# EAGLE design frisk-led-test (EAGLE 7.5.0)
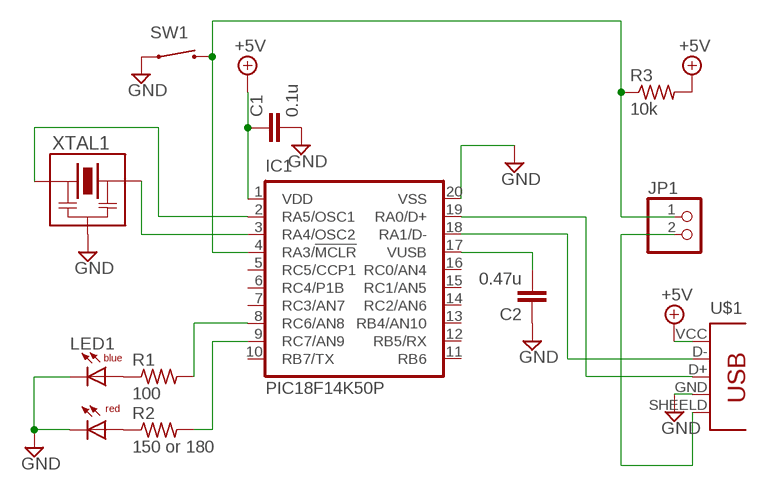
[diagram p0: schematic, sheet 1]

## Parts
C1  0.1u  C-EU025-024X044  [C025-024X044]
C2  0.47u  C-EU075-032X103  [C075-032X103]
IC1  PIC18F14K50P  [DIL20]
JP1  PINHD-1X2  [1X02]
LED1  SML-02  [SML-02]
R1  100  R-US_0204/7  [0204/7]
R2  150 or 180  R-US_0204/7  [0204/7]
R3  10k  R-US_0204/7  [0204/7]
SW1  TVBP06  [TVBP06]
U$1  TYPE-A+SHILED  [TYPE-A]
XTAL1  CSTCE12M0G15L  [CSTCE]

## Nets
+5V: C1.1 IC1.1(VDD) R3.2 U$1.VCC
GND: C1.2 C2.1 IC1.20(VSS) LED1.1(CC1) LED1.3(CC2) SW1.1 U$1.GND XTAL1.2(GND)
N$1: LED1.2(AB) R1.1
N$2: LED1.4(AR) R2.1
N$3: IC1.3(RA4/OSC2) XTAL1.3(RIT)
N$4: IC1.2(RA5/OSC1) XTAL1.1(LFT)
N$5: IC1.8(RC6/AN8) R1.2
N$6: IC1.19(RA0/D+) U$1.D+
N$7: IC1.18(RA1/D-) U$1.D-
N$8: IC1.9(RC7/AN9) R2.2
N$9: IC1.4(RA3/!MCLR!) JP1.1 R3.1 SW1.2
N$10: C2.2 IC1.17(VUSB)
N$11: JP1.2 U$1.SHEELD
Unconnected: IC1.5(RC5/CCP1) IC1.6(RC4/P1B) IC1.7(RC3/AN7) IC1.10(RB7/TX) IC1.11(RB6) IC1.12(RB5/RX) IC1.13(RB4/AN10) IC1.14(RC2/AN6) IC1.15(RC1/AN5) IC1.16(RC0/AN4)

## Library data of the parts
C1 C2 = rcl:C-EU: CAPACITOR, European symbol
IC1 = pic18f14k50:PIC18F14K50
JP1 = pinhead:PINHD-1X2: PIN HEADER
LED1 = led-smd:SML-02: 2color led http://akizukidenshi.com/catalog/g/gI-09437/
R1-R3 = rcl:R-US_: RESISTOR, American symbol
SW1 = switches:TVBP06: 2pin switch. http://akizukidenshi.com/catalog/g/gP-08074/
U$1 = usb-connector:TYPE-A+SHILED
XTAL1 = murata-ceralok:CSTCE12M0G15L: Murata CERALOCK https://jp.rs-online.com/web/p/ceramic-resonators/7926527/

## Board
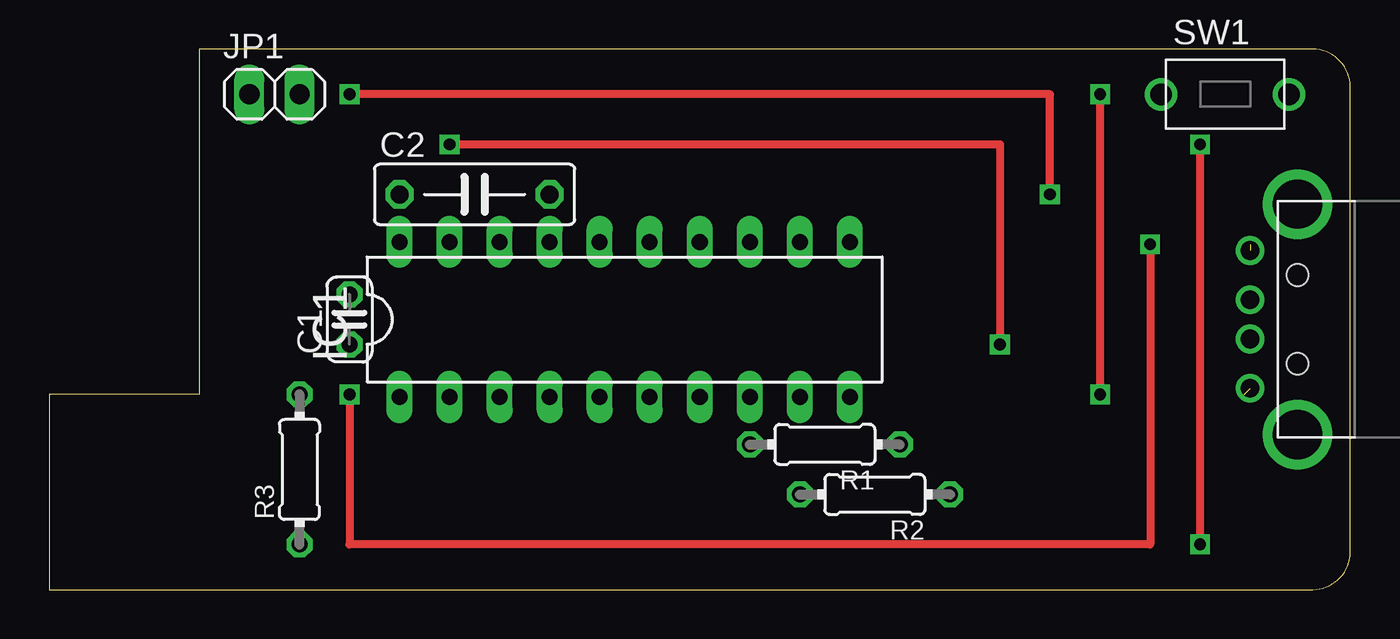
[diagram p1: board, top side]
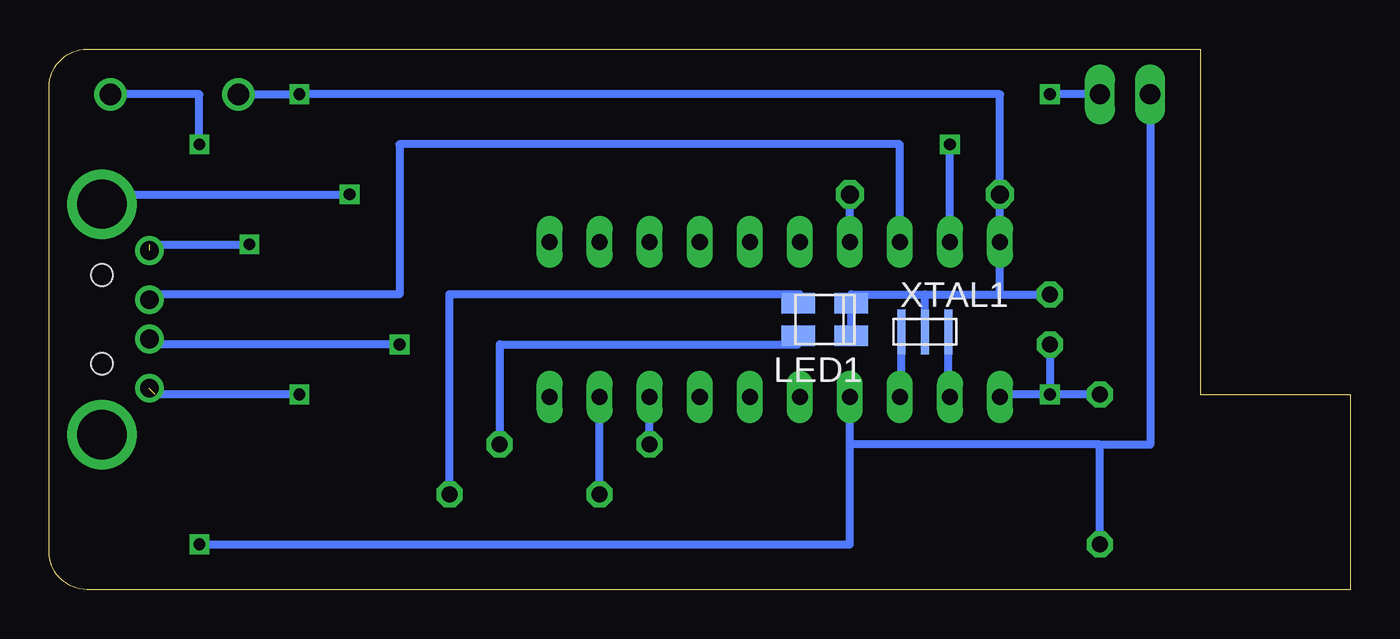
[diagram p2: board, bottom side, seen from below]

Size 66.04 x 27.44 mm. Coordinates in mm from the lower left corner, seen from the top.
Outline: 0,9.91 0,0 64.14,0 arc90 66.04,1.9 66.04,25.54 arc90 64.14,27.44 7.62,27.44 7.62,9.91 0,9.91
Copper layers (1*16): Top 0.035mm / dielectric 1.5mm / Bottom 0.035mm
Design rules "default": minimum track width 10mil, minimum drill 24mil, track to track 8mil, track to pad 8mil, pad to pad 8mil, via to via 8mil, smd to smd 8mil, copper to edge 40mil, drill to drill 8mil, minimum pad ring 10mil, minimum via ring 8mil, stop-mask expansion 4mil, vias tented up to drill 0mil, thermal gap 10mil

### Footprints (pad centres in the part's own frame; a part is rotated, then mirrored left to right if it is on the bottom)
C025-024X044 = drill 0.813 octagon: 1 -1.27,0; 2 1.27,0
C075-032X103 = drill 0.914 octagon: 1 -3.81,0; 2 3.81,0
DIL20 = drill 0.813 long: 1 -11.43,-3.937; 2 -8.89,-3.937; 3 -6.35,-3.937; 4 -3.81,-3.937; 5 -1.27,-3.937; 6 1.27,-3.937; 7 3.81,-3.937; 8 6.35,-3.937; 9 8.89,-3.937; 10 11.43,-3.937; 11 11.43,3.937; 12 8.89,3.937; 13 6.35,3.937; 14 3.81,3.937; 15 1.27,3.937; 16 -1.27,3.937; 17 -3.81,3.937; 18 -6.35,3.937; 19 -8.89,3.937; 20 -11.43,3.937
1X02 = drill 1.016 long: 1 -1.27,0; 2 1.27,0
SML-02 = smd 1.7 x 1.05: 1 -1.35,0.825; 2 1.35,0.825; 3 -1.35,-0.825; 4 1.35,-0.825
0204/7 = drill 0.813 octagon: 1 -3.81,0; 2 3.81,0
TVBP06 = drill 1.1: 1 -3.25,0; 2 3.25,0
TYPE-A = drill 0.95: D+ 1,0; D- -1,0; GND 3.5,0; VCC -3.5,0 | drill 2.5: SHEELD -5.85,2.4; SHEELD2 5.85,2.4 | hole 1.1: -2.25,2.4; 2.25,2.4
CSTCE = smd 0.4 x 2.3: 1 1.2,0; 2 0,0; 3 -1.2,0

### Placement (x,y rotation side)
C1  15.24,13.72 90 top
C2  21.59,20.07 0 top
IC1  29.21,13.72 0 top
JP1  11.43,25.15 0 top
LED1  26.67,13.72 180 bottom
R1  39.37,7.37 180 top
R2  41.91,4.83 180 top
R3  12.7,6.1 90 top
SW1  59.69,25.15 0 top
U$1  60.96,13.72 270 top
XTAL1  21.59,13.09 0 bottom

### Tracks (layer width: path | path; a pad name or v marks a point on that pad's centre or on a via)
+5V  (via drill 0.6)  (1 unrouted)
  Top 0.406: v55.88,17.53 55.88,2.29 15.24,2.29 v15.24,9.91
  Bottom 0.406: C1.1 v15.24,9.91 | v15.24,9.91 17.65,9.91 IC1.1 | 60.96,17.53 v55.88,17.53 | R3.2 v15.24,9.91
GND  (via drill 0.6)  (1 unrouted)
  Top 0.406: v53.34,25.15 v53.34,9.91
  Bottom 0.406: 17.78,14.99 IC1.20 C2.1 17.78,25.15 v53.34,25.15 SW1.1 | XTAL1.2 21.59,14.99 | 21.59,14.99 17.78,14.99 | 17.78,14.99 C1.2 | 21.59,14.99 25.32,14.99 LED1.3 LED1.1 | v53.34,9.91 60.65,9.91
N$1
  Bottom 0.406: R1.1 43.18,12.45 28.02,12.45 LED1.2
N$2
  Bottom 0.406: R2.1 45.72,14.99 28.02,14.99 | 27.94,14.99 28.02,14.99 | 28.02,14.99 LED1.4
N$3
  Bottom 0.406: IC1.3 22.79,9.78 XTAL1.3
N$4
  Bottom 0.406: IC1.2 20.39,9.78 XTAL1.1
N$5
  Bottom 0.406: R1.2 IC1.8
N$6  (via drill 0.6)
  Top 0.406: v20.32,22.61 48.26,22.61 v48.26,12.45
  Bottom 0.406: IC1.19 v20.32,22.61 | v48.26,12.45 60.69,12.45 U$1.D+
N$7
  Bottom 0.406: IC1.18 22.86,22.61 48.26,22.61 48.26,14.99 60.69,14.99 U$1.D-
N$8
  Bottom 0.406: R2.2 IC1.9
N$9  (via drill 0.6)
  Top 0.406: v58.42,2.29 v58.42,22.61
  Bottom 0.406: 12.7,7.37 25.4,7.37 | 25.4,7.37 IC1.4 | 63.5,25.15 SW1.2 58.42,25.15 v58.42,22.61 | v58.42,2.29 25.4,2.29 25.4,7.37 | JP1.1 10.16,7.37 12.7,7.37 | R3.1 12.7,7.37
N$10
  Bottom 0.406: C2.2 IC1.17 25.4,17.53
N$11  (via drill 0.6)
  Top 0.406: v50.8,20.07 50.8,25.15 v15.24,25.15
  Bottom 0.406: U$1.SHEELD 63.36,19.93 63.5,20.07 v50.8,20.07 | JP1.2 v15.24,25.15